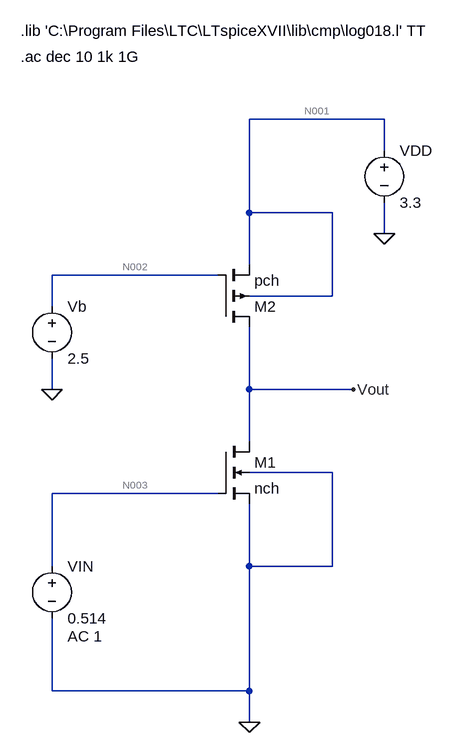
[diagram p0: schematic cs-stage.asc]
cs-stage.asc, the LTspice schematic file:
Version 4
SHEET 1 880 1060
WIRE 416 112 208 112
WIRE 416 160 416 112
WIRE 208 256 208 112
WIRE 336 256 208 256
WIRE 416 288 416 240
WIRE 208 336 208 256
WIRE 160 352 -96 352
WIRE 336 384 336 256
WIRE 336 384 208 384
WIRE -96 400 -96 352
WIRE -96 528 -96 480
WIRE 208 528 208 432
WIRE 368 528 208 528
WIRE 208 608 208 528
WIRE 336 656 208 656
WIRE 160 688 -96 688
WIRE -96 800 -96 688
WIRE 208 800 208 704
WIRE 336 800 336 656
WIRE 336 800 208 800
WIRE -96 992 -96 880
WIRE 208 992 208 800
WIRE 208 992 -96 992
WIRE 208 1040 208 992
FLAG 416 288 0
FLAG 368 528 Vout
FLAG 208 1040 0
FLAG -96 528 0
SYMBOL nmos4 160 608 R0
SYMATTR InstName M1
SYMATTR Value nch
SYMATTR Value2 l=0.18u w=36u
SYMBOL pmos4 160 432 M180
SYMATTR InstName M2
SYMATTR Value pch
SYMATTR Value2 l=0.36u w=18u
SYMBOL voltage 416 144 R0
WINDOW 123 0 0 Left 0
WINDOW 39 0 0 Left 0
SYMATTR InstName VDD
SYMATTR Value 3.3
SYMBOL voltage -96 784 R0
WINDOW 123 24 124 Left 2
WINDOW 39 0 0 Left 0
SYMATTR Value2 AC 1
SYMATTR InstName VIN
SYMATTR Value 0.514
SYMBOL voltage -96 384 R0
WINDOW 123 0 0 Left 0
WINDOW 39 0 0 Left 0
SYMATTR InstName Vb
SYMATTR Value 2.5
TEXT -144 -24 Left 2 !.lib 'C:\\Program Files\\LTC\\LTspiceXVII\\lib\\cmp\\log018.l' TT
TEXT -144 16 Left 2 !.ac dec 10 1k 1G

The netlist it stands for:
* cs-stage.asc
M1 Vout N003 0 0 nch l=0.18u w=36u
M2 Vout N002 N001 N001 pch l=0.36u w=18u
VDD N001 0 3.3
VIN N003 0 0.514 AC 1
Vb N002 0 2.5
.model NMOS NMOS
.model PMOS PMOS
.lib standard.mos
.lib 'C:\Program Files\LTC\LTspiceXVII\lib\cmp\log018.l' TT
.ac dec 10 1k 1G
.backanno
.end

* Results of the author's LTspice run, read from the files saved beside the schematic
* Operating Point, zero values left out:
*   V(vout) = 602.7 mV
*   V(n003) = 514 mV
*   V(n002) = 2.5 V
*   V(n001) = 3.3 V
*   Id(M2) = -204.7 µA
*   Ib(M2) = 276.9 nA
*   Is(M2) = 204.4 µA
*   Id(M1) = 204.7 µA
*   Is(M1) = -204.7 µA
*   I(Vdd) = -204.7 µA
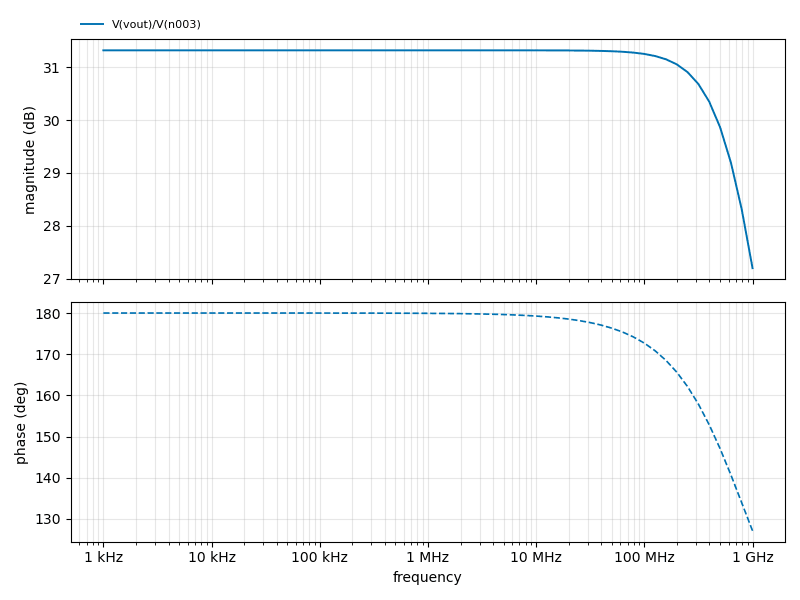
[diagram p1: AC Analysis of cs-stage.asc, plotted from the saved traces]
* AC Analysis, 1 run:
*   V(vout)/V(n003): 31.32 dB at 1 kHz, 27.20 dB at 1 GHz, peak 31.32 dB at 1 kHz, 3 dB below the peak at 794.4 MHz